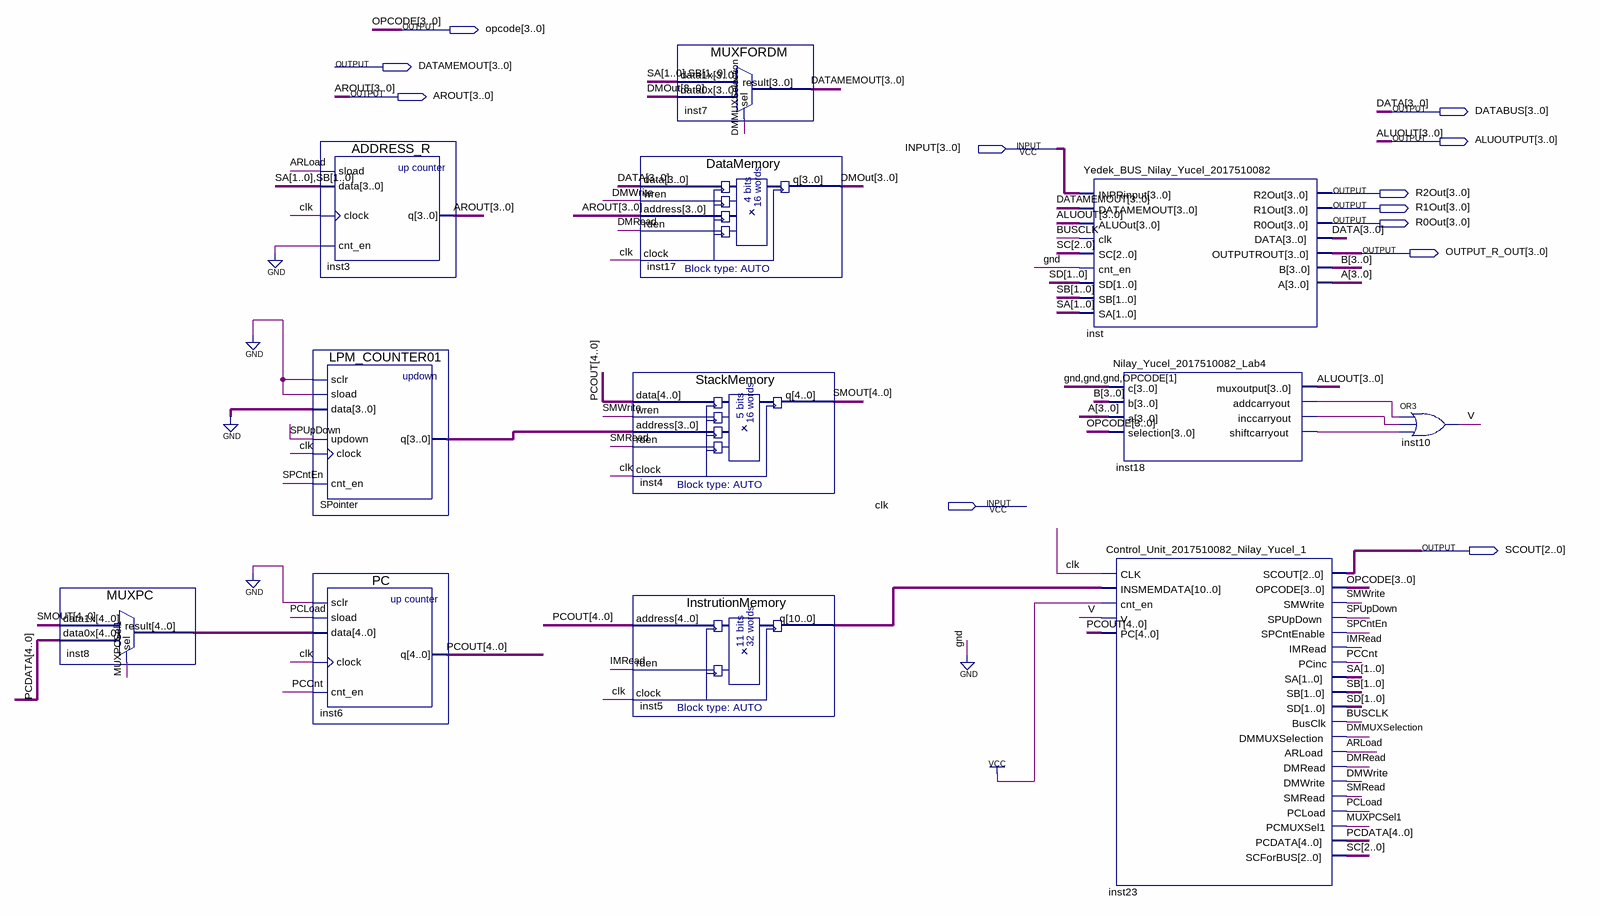
[diagram p0: schematic sheet]
// Quartus schematic 2017510082_Nilay_Yucel_DEUARCH.bdf as structural Verilog: 12 symbols, 12 pins
module \2017510082_Nilay_Yucel_DEUARCH  (
  input  [3:0] INPUT,
  input  clk,
  output [3:0] opcode,
  output [3:0] DATAMEMOUT,
  output [3:0] AROUT,
  output [3:0] DATABUS,
  output [3:0] ALUOUTPUT,
  output [3:0] R2Out,
  output [3:0] R1Out,
  output [3:0] R0Out,
  output [3:0] OUTPUT_R_OUT,
  output [2:0] SCOUT
);

  wire ARLoad, BUSCLK, DMMUXSelection, DMRead, DMWrite, IMRead, inst18_addcarryout, inst18_inccarryout,
       inst18_shiftcarryout, MUXPCSel1, PCCnt, PCLoad, SMRead, SMWrite, SPCntEn, SPUpDown, V;
  wire [1:0] SA, SB, SD;
  wire [2:0] SC;
  wire [3:0] A, B, DMOut, SPointer_q;
  wire [4:0] inst8_result, PCDATA, PCOUT, SMOUT;
  wire [10:0] inst5_q;

  MUXPC inst8 (.data1x(SMOUT), .data0x(PCDATA), .sel(MUXPCSel1), .result(inst8_result));
  LPM_COUNTER01 SPointer (
    .sclr(1'b0), .sload(1'b0), .data(4'b0000), .updown(SPUpDown), .clock(clk), .cnt_en(SPCntEn),
    .q(SPointer_q));
  PC inst6 (.sclr(1'b0), .sload(PCLoad), .data(inst8_result), .clock(clk), .cnt_en(PCCnt), .q(PCOUT));
  ADDRESS_R inst3 (.sload(ARLoad), .data({SA, SB}), .clock(clk), .cnt_en(1'b0), .q(AROUT));
  DataMemory inst17 (.data(DATABUS), .wren(DMWrite), .address(AROUT), .rden(DMRead), .clock(clk), .q(DMOut));
  StackMemory inst4 (.data(PCOUT), .wren(SMWrite), .address(SPointer_q), .rden(SMRead), .clock(clk), .q(SMOUT));
  InstrutionMemory inst5 (.address(PCOUT), .rden(IMRead), .clock(clk), .q(inst5_q));
  MUXFORDM inst7 (.data1x({SA, SB}), .data0x(DMOut), .sel(DMMUXSelection), .result(DATAMEMOUT));
  Yedek_BUS_Nilay_Yucel_2017510082 inst (
    .INPRinput(INPUT), .DATAMEMOUT(DATAMEMOUT), .ALUOut(ALUOUTPUT), .clk(BUSCLK), .SC(SC), .cnt_en(1'b0),
    .SD(SD), .SB(SB), .SA(SA), .R2Out(R2Out), .R1Out(R1Out), .R0Out(R0Out), .DATA(DATABUS),
    .OUTPUTROUT(OUTPUT_R_OUT), .B(B), .A(A));
  Nilay_Yucel_2017510082_Lab4 inst18 (
    .c({3'b000, opcode[1]}), .b(B), .a(A), .selection(opcode), .muxoutput(ALUOUTPUT),
    .addcarryout(inst18_addcarryout), .inccarryout(inst18_inccarryout), .shiftcarryout(inst18_shiftcarryout));
  Control_Unit_2017510082_Nilay_Yucel_1 inst23 (
    .CLK(clk), .INSMEMDATA(inst5_q), .cnt_en(1'b1), .V(V), .PC(PCOUT), .SCOUT(SCOUT), .OPCODE(opcode),
    .SMWrite(SMWrite), .SPUpDown(SPUpDown), .SPCntEnable(SPCntEn), .IMRead(IMRead), .PCinc(PCCnt), .SA(SA),
    .SB(SB), .SD(SD), .BusClk(BUSCLK), .DMMUXSelection(DMMUXSelection), .ARLoad(ARLoad), .DMRead(DMRead),
    .DMWrite(DMWrite), .SMRead(SMRead), .PCLoad(PCLoad), .PCMUXSel1(MUXPCSel1), .PCDATA(PCDATA), .SCForBUS(SC));
  or inst10 (V, inst18_addcarryout, inst18_inccarryout, inst18_shiftcarryout);

  // Other names for the same wires on the sheet: ALUOUT[3:0] = ALUOUTPUT; DATA[3:0] = DATABUS
endmodule
